# Altium project Battman.PrjPcb (part 2 of 3)

## Sheet AuxSupply_USB.SchDoc
size A4; SheetNumber: 6; SheetTotal: 10
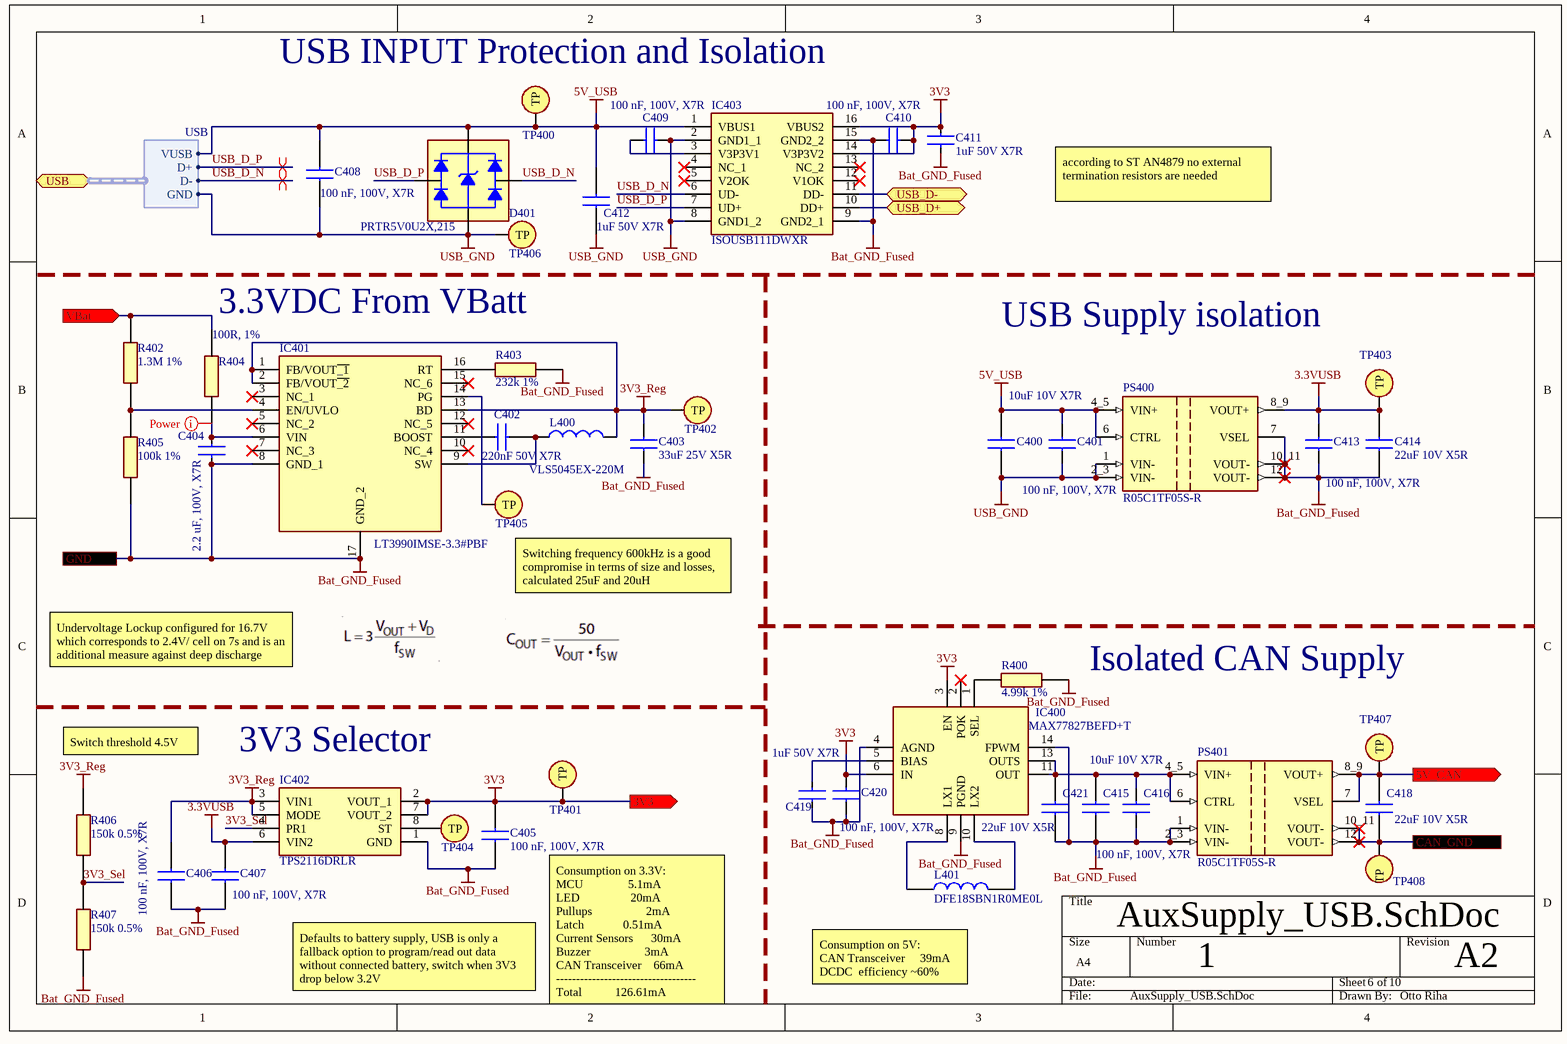
[diagram p5: AuxSupply_USB.SchDoc]

### Parts
C400  10uF 10V X7R  [GRM18x]
C401  100 nF, 100V, X7R  [MAJx16]
C402  220nF 50V X7R  [GRM18x]
C403  33uF 25V X5R  [CAPC3216X180N]
C404  2.2 uF, 100V, X7R  [CAPC2012X145N]
C405  100 nF, 100V, X7R  [MAJx16]
C406  100 nF, 100V, X7R  [MAJx16]
C407  100 nF, 100V, X7R  [MAJx16]
C408  100 nF, 100V, X7R  [MAJx16]
C409  100 nF, 100V, X7R  [MAJx16]
C410  100 nF, 100V, X7R  [MAJx16]
C411  1uF 50V X7R  [CAPC1608X90N]
C412  1uF 50V X7R  [CAPC1608X90N]
C413  100 nF, 100V, X7R  [MAJx16]
C414  22uF 10V X5R  [CAPC1608X105N]
C415  10uF 10V X7R  [GRM18x]
C416  100 nF, 100V, X7R  [MAJx16]
C418  22uF 10V X5R  [CAPC1608X105N]
C419  1uF 50V X7R  [CAPC1608X90N]
C420  100 nF, 100V, X7R  [MAJx16]
C421  22uF 10V X5R  [CAPC1608X105N]
D401  PRTR5V0U2X,215  [PRTR5V0U2X]
IC400  MAX77827BEFD+T  [MAX77827BEFDT]
IC401  LT3990IMSE-3.3#PBF  [SOP50P490X110-17N]
IC402  TPS2116DRLR  [SOTFL50P160X60-8N]
IC403  ISOUSB111DWXR  [SOP65P1030X260-16N]
L400  VLS5045EX-220M  [VLS5045EX330M]
L401  DFE18SBN1R0ME0L  [DFE18SAN1R0ME0L]
PS400  R05C1TF05S-R  [CONV_R05C1TF05S-R]
PS401  R05C1TF05S-R  [CONV_R05C1TF05S-R]
R400  4.99k 1%  [RESC0603X26N]
R402  1.3M 1%  [RESC1608X55N]
R403  232k 1%  [RESC1608X50N]
R404  100R, 1%  [RESC1608X50N]
R405  100k 1%  [RESC1608X55N]
R406  150k 0.5%  [ERA3AEB101V]
R407  150k 0.5%  [ERA3AEB101V]
TP400  Testpoint  [Testpoint]  (value not drawn)
TP401  Testpoint  [Testpoint]  (value not drawn)
TP402  Testpoint  [Testpoint]  (value not drawn)
TP403  Testpoint  [Testpoint]  (value not drawn)
TP404  Testpoint  [Testpoint]  (value not drawn)
TP405  Testpoint  [Testpoint]  (value not drawn)
TP406  Testpoint  [Testpoint]  (value not drawn)
TP407  Testpoint  [Testpoint]  (value not drawn)
TP408  Testpoint  [Testpoint]  (value not drawn)

### Ports
3V3 (out, see Main[4D], MCU[1A], PowerPath[1B], Singlepath[1B]), 5V_CAN (out, see Main[4D], MCU[1C]), CAN_GND (see Main[4D], MCU[1C]), GND (see Main[4D], LTC_Hardware[1D], MCU[1A], PowerPath[1B], Singlepath[1C]), USB (bidir, harness USB, see Main[4D]), USB_D+ (bidir, see Main[4D], MCU[4C]), USB_D- (bidir, see Main[4D], MCU[4C]), VBat (in, see Main[4D])

### Harnesses
USB: VUSB, D+, D-, GND

### Nets
3.3VUSB: C407.2 C413.1 C414.2 IC402.6(VIN2) PS400.8_9(VOUT+) TP403.1(TP)
3V3: C405.2 C410.1 C411.2 C420.1 IC400.3(EN) IC400.6(IN) IC402.2(VOUT_1) IC402.7(VOUT_2) IC403.14(V3P3V2) IC403.16(VBUS2) TP401.1(TP) ; port 3V3  [project net 3.3V]
3V3_Reg: C403.2 C406.2 IC401.1(FB/VOUT~{_1}) IC401.2(FB/VOUT~{_2}) IC401.13(BD) IC402.3(VIN1) IC402.5(MODE) L400.2 R406.2 TP402.1(TP)
5V: C418.2 PS401.7(VSEL) PS401.8_9(VOUT+) TP407.1(TP) ; port 5V_CAN
5V_USB: C400.2 C401.1 C408.2 C412.1 D401.4(supply_voltage) IC403.1(VBUS1) PS400.4_5(VIN+) PS400.6(CTRL) TP400.1(TP) ; port USB.VUSB
Bat_GND_Fused: C403.1 C404.1 C405.1 C406.1 C407.1 C410.2 C411.1 C413.2 C414.1 C415.1 C416.2 C419.1 C420.2 C421.1 IC400.4(AGND) IC400.9(PGND) IC400.14(FPWM) IC401.8(GND_1) IC401.17(GND_2) IC402.1(GND) IC403.9(GND2_1) IC403.15(GND2_2) PS400.7(VSEL) PS400.10_11(VOUT-) PS400.12(VOUT-) PS401.1(VIN-) PS401.2_3(VIN-) R400.2 R403.2 R405.1 R407.1 ; port GND
CAN_GND: C418.1 PS401.10_11(VOUT-) PS401.12(VOUT-) TP408.1(TP) ; port CAN_GND
USB_GND: C400.1 C401.2 C408.1 C409.1 C412.2 D401.1(ground) IC403.2(GND1_1) IC403.8(GND1_2) PS400.1(VIN-) PS400.2_3(VIN-) TP406.1(TP) ; port USB.GND
V_Bat_Fused: R402.2 R404.2 ; port VBat
3V3_Sel: IC402.4(PR1) R406.1 R407.2
USB_D_N: D401.3(input/output_2) IC403.6(UD-) ; port USB.D-
USB_D_P: D401.2(input/output_1) IC403.7(UD+) ; port USB.D+
USB_ISO_N: IC403.11(DD-) ; port USB_D-
USB_ISO_P: IC403.10(DD+) ; port USB_D+
NetC402_1: C402.1 IC401.11(BOOST)
NetC402_2: C402.2 IC401.9(SW) L400.1
NetC404_2: C404.2 IC401.6(VIN) R404.1
NetC409_2: C409.2 IC403.3(V3P3V1)
NetC415_2: C415.2 C416.1 C421.2 IC400.11(OUT) IC400.13(OUTS) PS401.4_5(VIN+) PS401.6(CTRL)
NetC419_2: C419.2 IC400.5(BIAS)
NetIC400_1: IC400.1(SEL) R400.1
NetIC400_8: IC400.8(LX1) L401.1
NetIC400_10: IC400.10(LX2) L401.2
NetIC401_4: IC401.4(EN/UVLO) R402.1 R405.2
NetIC401_14: IC401.14(PG) TP405.1(TP)
NetIC401_16: IC401.16(RT) R403.1
NetIC402_8: IC402.8(ST) TP404.1(TP)

Not connected (* = marked no-connect by the designer): IC400 2(POK)*; IC401 3(NC_1)* 5(NC_2)* 7(NC_3)* 10(NC_4)* 12(NC_5)* 15(NC_6)*; IC403 4(NC_1)* 5(V2OK)* 12(V1OK)* 13(NC_2)*

### Layout directives
differential pair: USB_D_N, USB_D_P
net class Batt+: NetC404_2

### Notes on the sheet
- USB INPUT Protection and Isolation
- according to ST AN4879 no external termination resistors are needed
- 3.3VDC From VBatt
- USB Supply isolation
- (near TP405) Switching frequency 600kHz is a good compromise in terms of size and losses, calculated 25uF and 20uH
- Undervoltage Lockup configured for 16.7V which corresponds to 2.4V/ cell on 7s and is an additional measure against deep discharge
- Isolated CAN Supply
- Switch threshold 4.5V
- (near IC402) 3V3 Selector
- Defaults to battery supply, USB is only a fallback option to program/read out data without connected battery, switch when 3V3 drop below 3.2V
- (near L401) Consumption on 5V:
  CAN Transceiver     39mA
  DCDC  efficiency ~60%
- 1
- A2
- Consumption on 3.3V:
  MCU 	             5.1mA
  LED  	              20mA
  Pullups 	                2mA
  Latch 	           0.51mA
  Current Sensors      30mA
  Buzzer 	                3mA
  CAN Transceiver    66mA
  -----------------------------------
  Total 	         126.61mA
- Otto Riha

### Library data of the parts
C400 C415 = GRM188Z71A106MA73D: Capacitor; Manufacturer_Name: Murata Electronics; Datasheet Link: https://search.murata.co.jp/Ceramy/image/img/A01X/G101/ENG/GRM188Z71A106MA73-01A.pdf; Height: 0.9mm; Manufacturer_Part_Number: GRM188Z71A106MA73D; Mouser Part Number: 81-GRM188Z71A106MA3D; Mouser Price/Stock: https://www.mouser.co.uk/ProductDetail/Murata-Electronics/GRM188Z71A106MA73D?qs=Y%252BBGkTaltXt4aDn0%2FsxyNQ%3D%3D; Arrow Part Number: GRM188Z71A106MA73D; Arrow Price/Stock: https://www.arrow.com/en/products/grm188z71a106ma73d/murata-manufacturing?utm_currency=USD&region=europe
C401 C405-C410 C413 C416 C420 = MAJCH168BB7104KTEA01: as C303 on sheet LTC_Hardware; Datasheet Link: https://ds.yuden.co.jp/TYCOMPAS/or/detail?pn=MAJCH168BB7104KTEA01; Height: 0.8mm; Manufacturer_Part_Number: MAJCH168BB7104KTEA01; Mouser Part Number: 963-MAJCH168BB7104KT; Mouser Price/Stock: https://www.mouser.co.uk/ProductDetail/TAIYO-YUDEN/MAJCH168BB7104KTEA01?qs=ZcfC38r4PovaTBrG0IdezQ%3D%3D; Arrow Part Number: MAJCH168BB7104KTEA01; Arrow Price/Stock: https://www.arrow.com/en/products/majch168bb7104ktea01/taiyo-yuden?utm_currency=USD&region=nac; Supplier 1: Mouser; Supplier Part Number 1: 963-MAJCH168BB7104KT
C402 = GRM188R71H224KAC4J: Capacitor; Manufacturer_Name: Murata Electronics; Datasheet Link: https://search.murata.co.jp/Ceramy/image/img/A01X/G101/ENG/GRM188R71H224KAC4-01A.pdf; Height: 0.9mm; Manufacturer_Part_Number: GRM188R71H224KAC4J; Mouser Part Number: 81-GRM188R71H224KA4J; Mouser Price/Stock: https://www.mouser.co.uk/ProductDetail/Murata-Electronics/GRM188R71H224KAC4J?qs=jHkklCh7amjbWVXSvnFGBA%3D%3D; Arrow Part Number: GRM188R71H224KAC4J; Arrow Price/Stock: https://www.arrow.com/en/products/grm188r71h224kac4j/murata-manufacturing
C403 = C3216X5R1E336M160AC: Capacitor 33uF 25V X5R; Manufacturer_Name: TDK; Datasheet Link: https://product.tdk.com/info/en/catalog/datasheets/mlcc_commercial_midvoltage_en.pdf; Height: 1.8mm; Manufacturer_Part_Number: C3216X5R1E336M160AC; Mouser Part Number: 810-C3216X5R1E336M; Mouser Price/Stock: https://www.mouser.co.uk/ProductDetail/TDK/C3216X5R1E336M160AC?qs=LcTL%2F5vFEzFIMvFz4LzwTw%3D%3D; Arrow Part Number: C3216X5R1E336M160AC; Arrow Price/Stock: https://www.arrow.com/en/products/c3216x5r1e336m160ac/tdk
C404 = C2012X7R2A225K125AC: Capacitor 2.2 uF, 100V, X7R; Manufacturer_Name: TDK; Datasheet Link: https://product.tdk.com/info/en/catalog/datasheets/mlcc_commercial_midvoltage_en.pdf; Height: 1.45mm; Manufacturer_Part_Number: C2012X7R2A225K125AC; Mouser Part Number: 810-C2012X7R2225K125; Mouser Price/Stock: https://www.mouser.co.uk/ProductDetail/TDK/C2012X7R2A225K125AC?qs=17ckDYBRdekDf%2FwiwHq7Mg%3D%3D; Arrow Part Number: C2012X7R2A225K125AC; Arrow Price/Stock: https://www.arrow.com/en/products/c2012x7r2a225k125ac/tdk?utm_currency=USD&region=nac; Supplier 1: Mouser; Supplier Part Number 1: 810-C2012X7R2225K125
C411 C412 C419 = 06035C105MAT2A: Capacitor 1uF 50V X7R; Manufacturer_Name: Kyocera AVX; Datasheet Link: https://componentsearchengine.com/Datasheets/1/06031A100FAT2A.pdf; Height: 0.9mm; Manufacturer_Part_Number: 06035C105MAT2A; Mouser Part Number: 581-06035C105MAT2A; Mouser Price/Stock: https://www.mouser.co.uk/ProductDetail/KYOCERA-AVX/06035C105MAT2A?qs=%252BdQmOuGyFcHMsevPtc6OZQ%3D%3D; Value: 1uF
C414 C418 C421 = CL10A226MP8NUNE: Capacitor; Manufacturer_Name: SAMSUNG; Datasheet Link: https://datasheet.datasheetarchive.com/originals/distributors/Datasheets-DGA10/2407063.pdf; Height: 1.05mm; Manufacturer_Part_Number: CL10A226MP8NUNE; Mouser Part Number: 187-CL10A226MP8NUNE; Mouser Price/Stock: https://www.mouser.co.uk/ProductDetail/Samsung-Electro-Mechanics/CL10A226MP8NUNE?qs=gRKWieUq2Hb5O0PTfRKzDQ%3D%3D; Arrow Part Number: CL10A226MP8NUNE; Arrow Price/Stock: https://www.arrow.com/en/products/cl10a226mp8nune/samsung-electro-mechanics?region=europe
D401 = PRTR5V0U2X,215: Diode; Manufacturer_Name: Nexperia; Datasheet Link: https://assets.nexperia.com/documents/data-sheet/PRTR5V0U2X.pdf; Height: 1.1mm; Manufacturer_Part_Number: PRTR5V0U2X,215; Mouser Part Number: 771-PRTR5V0U2X-T/R; Mouser Price/Stock: https://www.mouser.co.uk/ProductDetail/Nexperia/PRTR5V0U2X215?qs=LOCUfHb8d9sDkgY4cRj8Lw%3D%3D; Arrow Part Number: PRTR5V0U2X,215; Arrow Price/Stock: https://www.arrow.com/en/products/prtr5v0u2x215/nexperia?utm_currency=USD&region=europe
IC400 = MAX77827BEFD+T: Integrated Circuit; Manufacturer_Name: Analog Devices; Datasheet Link: https://www.analog.com/media/en/technical-documentation/data-sheets/MAX77827.pdf; Height: 0.6mm; Manufacturer_Part_Number: MAX77827BEFD+T; Mouser Part Number: 700-MAX77827BEFD+T; Mouser Price/Stock: https://www.mouser.co.uk/ProductDetail/Analog-Devices-Maxim-Integrated/MAX77827BEFD%2bT?qs=yqaQSyyJnNgFOTHEkqA3ww%3D%3D; Arrow Part Number: MAX77827BEFD+T; Arrow Price/Stock: https://www.arrow.com/en/products/max77827befdt/analog-devices?utm_currency=USD&region=nac
IC401 = LT3990IMSE-3.3#PBF: Integrated Circuit; Manufacturer_Name: Analog Devices; Datasheet Link: https://www.analog.com/LT3990/datasheet; Height: 1.1mm; Manufacturer_Part_Number: LT3990IMSE-3.3#PBF; Mouser Part Number: 584-3990IMSE-3.3PBF; Mouser Price/Stock: https://www.mouser.co.uk/ProductDetail/Analog-Devices/LT3990IMSE-3.3PBF?qs=hVkxg5c3xu8pU5y8AinUWQ%3D%3D; Arrow Part Number: LT3990IMSE-3.3#PBF; Arrow Price/Stock: https://www.arrow.com/en/products/lt3990imse-3.3pbf/analog-devices?region=nac
IC402 = TPS2116DRLR: Integrated Circuit; Manufacturer_Name: Texas Instruments; Datasheet Link: https://www.ti.com/lit/gpn/tps2116; Height: 0.6mm; Manufacturer_Part_Number: TPS2116DRLR; Mouser Part Number: 595-TPS2116DRLR; Mouser Price/Stock: https://www.mouser.co.uk/ProductDetail/Texas-Instruments/TPS2116DRLR?qs=aP1CjGhiNiGo3XAyXcVPaQ%3D%3D; Arrow Part Number: TPS2116DRLR; Arrow Price/Stock: https://www.arrow.com/en/products/tps2116drlr/texas-instruments?utm_currency=USD&region=nac
IC403 = ISOUSB111DWXR: Integrated Circuit; Manufacturer_Name: Texas Instruments; Datasheet Link: https://www.ti.com/lit/ds/symlink/isousb111.pdf?ts=1669697942868&ref_url=https%253A%252F%252Fwww.ti.com%252Fproduct%252FISOUSB111%253FkeyMatch%253DISOUSB111DWXR%2526tisearch%253Dsearch-everything%2526usecase%253DOPN; Height: 2.6mm; Manufacturer_Part_Number: ISOUSB111DWXR; Mouser Part Number: 595-ISOUSB111DWXR; Mouser Price/Stock: https://www.mouser.co.uk/ProductDetail/Texas-Instruments/ISOUSB111DWXR?qs=Y0Uzf4wQF3msEozH7EwD3g%3D%3D; Arrow Part Number: ISOUSB111DWXR; Arrow Price/Stock: https://www.arrow.com/en/products/isousb111dwxr/texas-instruments?region=nac
L400 = VLS5045EX-220M: Inductor; Manufacturer_Name: TDK; Datasheet Link: https://product.tdk.com/system/files/dam/doc/product/inductor/inductor/smd/catalog/inductor_commercial_power_vls5045ex_en.pdf; Height: 4mm; Manufacturer_Part_Number: VLS5045EX-220M; Mouser Part Number: 810-VLS5045EX-220M; Mouser Price/Stock: https://www.mouser.co.uk/ProductDetail/TDK/VLS5045EX-220M?qs=oF%2FSscNnLpAAQL9ec5VdpA%3D%3D; Arrow Part Number: VLS5045EX-220M; Arrow Price/Stock: https://www.arrow.com/en/products/vls5045ex-220m/tdk?region=nac
L401 = DFE18SBN1R0ME0L: Inductor; Manufacturer_Name: Murata Electronics; Datasheet Link: https://search.murata.co.jp/Ceramy/image/img/P02/JETE243A-0041.pdf; Height: 0.8mm; Manufacturer_Part_Number: DFE18SBN1R0ME0L; Mouser Part Number: 81-DFE18SBN1R0ME0L; Mouser Price/Stock: https://www.mouser.co.uk/ProductDetail/Murata-Electronics/DFE18SBN1R0ME0L?qs=byeeYqUIh0Mps9dQtDnpsA%3D%3D
PS400 PS401 = R05C1TF05S-R: MF: {'manufacturer': u'Recom Power'}; Package: None; Price: None; Value: *; MP: R05C1TF05S-R; Availability: Unavailable
R400 = CR0201-FW-4991GLF: Resistor; Manufacturer_Name: Bourns; Datasheet Link: https://www.bourns.com/pdfs/chpreztr.pdf; Height: 0.26mm; Manufacturer_Part_Number: CR0201-FW-4991GLF; Mouser Part Number: 652-CR0201FW-4991GLF; Mouser Price/Stock: https://www.mouser.co.uk/ProductDetail/Bourns/CR0201-FW-4991GLF?qs=W7X4MxMep48JtJbJXkcmpg%3D%3D
R402 = MCT0603MD1304BP500: Resistor 1.3M 1%; Manufacturer_Name: Vishay; Datasheet Link: http://www.vishay.com/docs/28705/mcx0x0xpro.pdf; Height: 0.55mm; Manufacturer_Part_Number: MCT0603MD1304BP500; Mouser Part Number: 594-MCT0603MD1304BP5; Mouser Price/Stock: https://www.mouser.co.uk/ProductDetail/Vishay/MCT0603MD1304BP500?qs=Jslch3jnSjn3NEL17BAJuQ%3D%3D; Value: 1.3M; Supplier 1: Mouser; Supplier Part Number 1: 594-MCT0603MD1304BP5
R403 = CRCW0603232KFKEA: Resistor; Manufacturer_Name: Vishay; Datasheet Link: http://www.vishay.com/docs/20035/dcrcwe3.pdf; Height: 0.5mm; Manufacturer_Part_Number: CRCW0603232KFKEA; Mouser Part Number: 71-CRCW0603-232K-E3; Mouser Price/Stock: https://www.mouser.co.uk/ProductDetail/Vishay-Dale/CRCW0603232KFKEA?qs=NHKSztHah43mx5UrSmXOxA%3D%3D; Arrow Part Number: CRCW0603232KFKEA; Arrow Price/Stock: https://www.arrow.com/en/products/crcw0603232kfkea/vishay
R404 = CRCW0603100RFKEA: Resistor 100R, 1%; Manufacturer_Name: Vishay; Datasheet Link: http://www.vishay.com/docs/20035/dcrcwe3.pdf; Height: 0.5mm; Manufacturer_Part_Number: CRCW0603100RFKEA; Mouser Part Number: 71-CRCW0603-100-E3; Mouser Price/Stock: https://www.mouser.co.uk/ProductDetail/Vishay-Dale/CRCW0603100RFKEA?qs=90AHS1y%2FsidGWjjxZAupKg%3D%3D; Arrow Part Number: CRCW0603100RFKEA; Arrow Price/Stock: https://www.arrow.com/en/products/crcw0603100rfkea/vishay?utm_currency=USD&region=europe; Value: 100R; Supplier 1: Mouser; Supplier Part Number 1: 71-CRCW0603-100-E3
R405 = CRCW0603100KFKEAC: Resistor 100k, 1%; Manufacturer_Name: Vishay; Datasheet Link: https://www.mouser.com/datasheet/2/427/crcwce3-1223726.pdf; Height: 0.55mm; Manufacturer_Part_Number: CRCW0603100KFKEAC; Mouser Part Number: 71-CRCW0603100KFKEAC; Mouser Price/Stock: https://www.mouser.co.uk/ProductDetail/Vishay-Dale/CRCW0603100KFKEAC?qs=E3Y5ESvWgWPxzfNYyMgX1w%3D%3D; Arrow Part Number: CRCW0603100KFKEAC; Arrow Price/Stock: https://www.arrow.com/en/products/crcw0603100kfkeac/vishay?utm_currency=USD&region=nac; Value: 100k; Supplier 1: Mouser; Supplier Part Number 1: 71-CRCW0603100KFKEAC
R406 R407 = ERA-3AED154V: Resistor 150k 0.5%; Manufacturer_Name: Panasonic; Datasheet Link: https://industrial.panasonic.com/cdbs/www-data/pdf/RDM0000/AOA0000C307.pdf; Height: 0.55mm; Manufacturer_Part_Number: ERA-3AED154V; Mouser Part Number: 667-ERA-3AED154V; Mouser Price/Stock: https://www.mouser.co.uk/ProductDetail/Panasonic/ERA-3AED154V?qs=MNPzkKEzRtSm98HasUBZjQ%3D%3D; Arrow Part Number: ERA-3AED154V; Arrow Price/Stock: https://www.arrow.com/en/products/era-3aed154v/panasonic?region=nac; Supplier 1: Mouser; Supplier Part Number 1: 667-ERA-3AED154V

## Sheet LTC_Soft.SchDoc
size A4; SheetNumber: 7; SheetTotal: 10
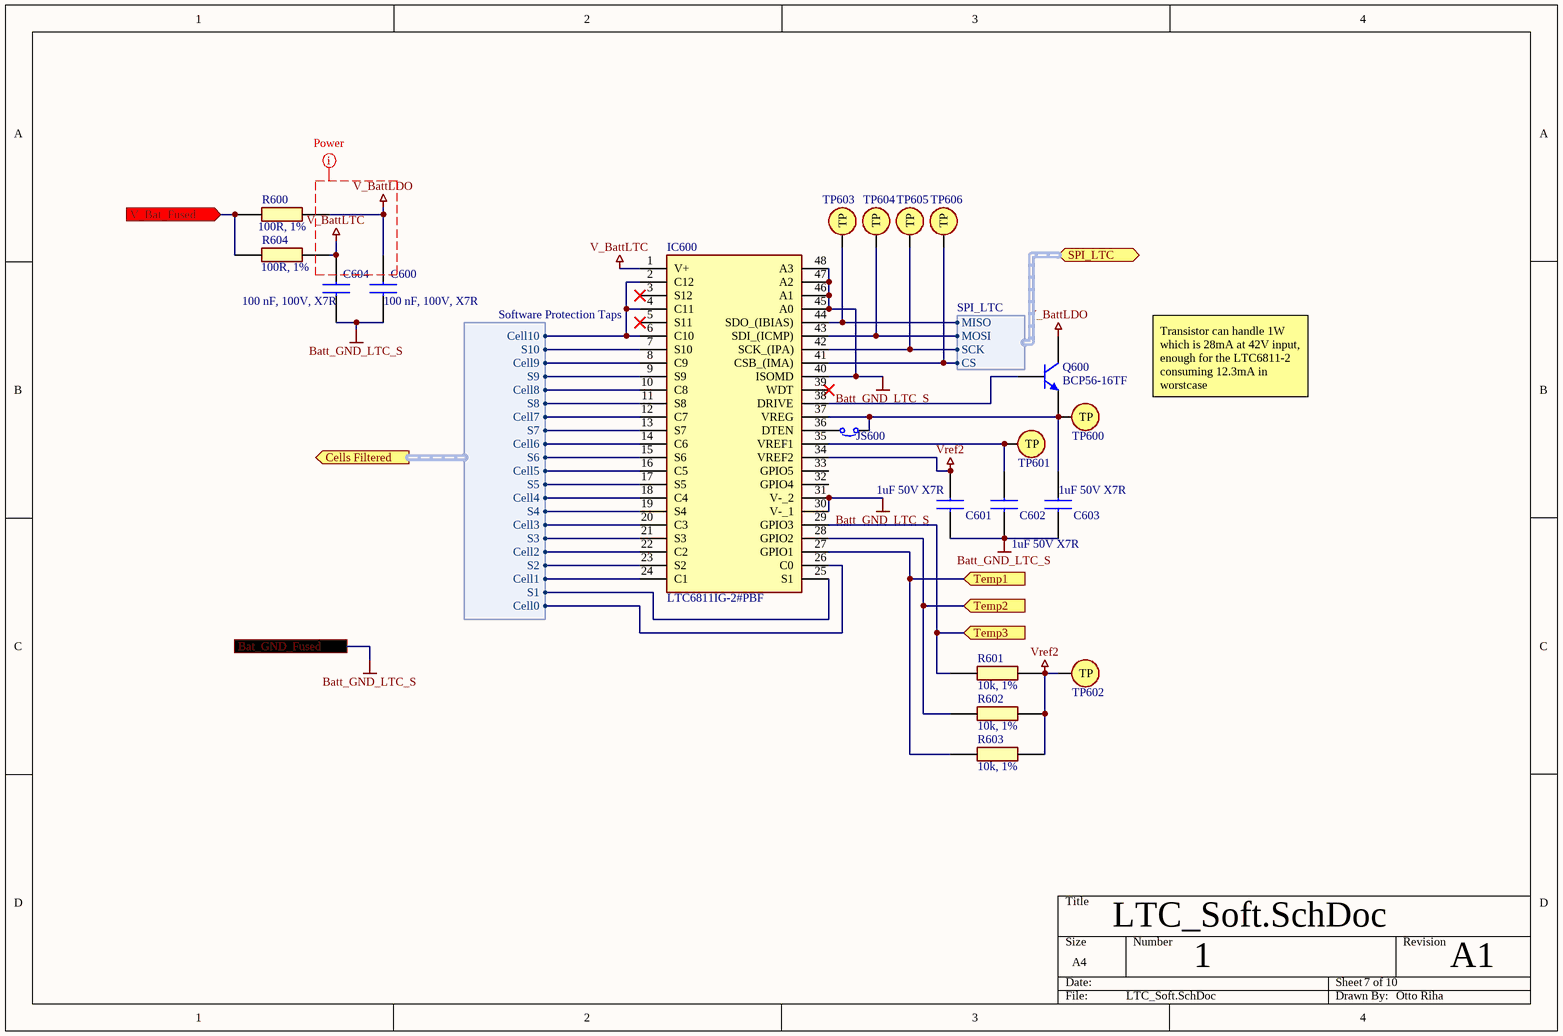
[diagram p6: LTC_Soft.SchDoc]

### Parts
C600  100 nF, 100V, X7R  [MAJx16]
C601  1uF 50V X7R  [CAPC1608X90N]
C602  1uF 50V X7R  [CAPC1608X90N]
C603  1uF 50V X7R  [CAPC1608X90N]
C604  100 nF, 100V, X7R  [MAJx16]
IC600  LTC6811IG-2#PBF  [SOP50P780X200-48N]
JS600  SolderJumper  [SolderJumper]  (value not drawn)
Q600  BCP56-16TF  [SOT230P700X180-4N]
R600  100R, 1%  [RESC1608X50N]
R601  value 10k, 1%  [RESC1608X50N]  (hidden comment: CRCW060310K0FKEI)
R602  value 10k, 1%  [RESC1608X50N]  (hidden comment: CRCW060310K0FKEI)
R603  value 10k, 1%  [RESC1608X50N]  (hidden comment: CRCW060310K0FKEI)
R604  100R, 1%  [RESC1608X50N]
TP600  Testpoint  [Testpoint]  (value not drawn)
TP601  Testpoint  [Testpoint]  (value not drawn)
TP602  Testpoint  [Testpoint]  (value not drawn)
TP603  Testpoint  [Testpoint]  (value not drawn)
TP604  Testpoint  [Testpoint]  (value not drawn)
TP605  Testpoint  [Testpoint]  (value not drawn)
TP606  Testpoint  [Testpoint]  (value not drawn)

### Ports
Bat_GND_Fused (see Main[4B]), Cells Filtered (out, harness Software Protection Taps, see Main[4B]), SPI_LTC (bidir, harness SPI_LTC, see Main[4B], MCU[3C]), Temp1 (in, see Main[4B]), Temp2 (in, see Main[4B]), Temp3 (in, see Main[4B]), V_Bat_Fused (in, see Main[4B])

### Harnesses
Software Protection Taps: Cell0, Cell1, Cell2, Cell3, Cell4, Cell5, Cell6, Cell7, Cell8, Cell9, Cell10, S1, S2, S3, S4, S5, S6, S7, S8, S9, S10
SPI_LTC: MOSI, MISO, SCK, CS

### Nets
Batt_GND_LTC_S: C600.1 C601.2 C602.2 C603.2 C604.1 IC600.30(V-_1) IC600.31(V-_2) IC600.40(ISOMD) IC600.45(A0) IC600.46(A1) IC600.47(A2) IC600.48(A3) ; port Bat_GND_Fused  [project net Bat_GND_Fused]
Cell0: IC600.26(C0) ; port Cells Filtered.Cell0
V_Bat_Fused: R600.1 R604.1 ; port V_Bat_Fused
V_BattLDO: C600.2 Q600.2(C) R600.2
V_BattLTC: C604.2 IC600.1(V+) R604.2
Vref2: C601.1 IC600.34(VREF2) R601.1 R602.1 R603.1 TP602.1(TP)
LTC_S_C1: IC600.24(C1) ; port Cells Filtered.Cell1
LTC_S_C2: IC600.22(C2) ; port Cells Filtered.Cell2
LTC_S_C3: IC600.20(C3) ; port Cells Filtered.Cell3
LTC_S_C4: IC600.18(C4) ; port Cells Filtered.Cell4
LTC_S_C5: IC600.16(C5) ; port Cells Filtered.Cell5
LTC_S_C6: IC600.14(C6) ; port Cells Filtered.Cell6
LTC_S_C7: IC600.12(C7) ; port Cells Filtered.Cell7
LTC_S_C8: IC600.10(C8) ; port Cells Filtered.Cell8
LTC_S_C9: IC600.8(C9) ; port Cells Filtered.Cell9
LTC_S_C10: IC600.2(C12) IC600.4(C11) IC600.6(C10) ; port Cells Filtered.Cell10
LTC_S_S1: IC600.25(S1) ; port Cells Filtered.S1
LTC_S_S2: IC600.23(S2) ; port Cells Filtered.S2
LTC_S_S3: IC600.21(S3) ; port Cells Filtered.S3
LTC_S_S4: IC600.19(S4) ; port Cells Filtered.S4
LTC_S_S5: IC600.17(S5) ; port Cells Filtered.S5
LTC_S_S6: IC600.15(S6) ; port Cells Filtered.S6
LTC_S_S7: IC600.13(S7) ; port Cells Filtered.S7
LTC_S_S8: IC600.11(S8) ; port Cells Filtered.S8
LTC_S_S9: IC600.9(S9) ; port Cells Filtered.S9
LTC_S_S10: IC600.7(S10) ; port Cells Filtered.S10
Temp1: IC600.27(GPIO1) R603.2 ; port Temp1
Temp2: IC600.28(GPIO2) R602.2 ; port Temp2
Temp3: IC600.29(GPIO3) R601.2 ; port Temp3
NetC602_1: C602.1 IC600.35(VREF1) TP601.1(TP)
NetC603_1: C603.1 IC600.37(VREG) JS600.2 Q600.3(E) TP600.1(TP)
NetIC600_36: IC600.36(DTEN) JS600.1
NetIC600_38: IC600.38(DRIVE) Q600.1(B)
NetIC600_41: IC600.41(CSB_(IMA)) TP606.1(TP) ; port SPI_LTC.CS
NetIC600_42: IC600.42(SCK_(IPA)) TP605.1(TP) ; port SPI_LTC.SCK
NetIC600_43: IC600.43(SDI_(ICMP)) TP604.1(TP) ; port SPI_LTC.MOSI
NetIC600_44: IC600.44(SDO_(IBIAS)) TP603.1(TP) ; port SPI_LTC.MISO

Not connected (* = marked no-connect by the designer): IC600 3(S12)* 5(S11)* 32(GPIO4) 33(GPIO5) 39(WDT)*

### Layout directives
net class Batt+: V_BattLDO, V_BattLTC

### Notes on the sheet
- Transistor can handle 1W which is 28mA at 42V input, enough for the LTC6811-2 consuming 12.3mA in worstcase
- 1
- A1
- Otto Riha

### Library data of the parts
C600 C604 = MAJCH168BB7104KTEA01: as C303 on sheet LTC_Hardware; Datasheet Link: https://ds.yuden.co.jp/TYCOMPAS/or/detail?pn=MAJCH168BB7104KTEA01; Height: 0.8mm; Manufacturer_Part_Number: MAJCH168BB7104KTEA01; Mouser Part Number: 963-MAJCH168BB7104KT; Mouser Price/Stock: https://www.mouser.co.uk/ProductDetail/TAIYO-YUDEN/MAJCH168BB7104KTEA01?qs=ZcfC38r4PovaTBrG0IdezQ%3D%3D; Arrow Part Number: MAJCH168BB7104KTEA01; Arrow Price/Stock: https://www.arrow.com/en/products/majch168bb7104ktea01/taiyo-yuden?utm_currency=USD&region=nac; Supplier 1: Mouser; Supplier Part Number 1: 963-MAJCH168BB7104KT
C601-C603 = 06035C105MAT2A: as C411 on sheet AuxSupply_USB; Datasheet Link: https://componentsearchengine.com/Datasheets/1/06031A100FAT2A.pdf; Height: 0.9mm; Manufacturer_Part_Number: 06035C105MAT2A; Mouser Part Number: 581-06035C105MAT2A; Mouser Price/Stock: https://www.mouser.co.uk/ProductDetail/KYOCERA-AVX/06035C105MAT2A?qs=%252BdQmOuGyFcHMsevPtc6OZQ%3D%3D; Value: 1uF
IC600 = LTC6811IG-2#PBF: Integrated Circuit; Manufacturer_Name: Analog Devices; Datasheet Link: https://datasheet.datasheetarchive.com/originals/distributors/DKDS42/DSANUWW0041878.pdf; Height: 2mm; Manufacturer_Part_Number: LTC6811IG-2#PBF; Mouser Part Number: 584-LTC6811IG-2#PBF; Mouser Price/Stock: https://www.mouser.co.uk/ProductDetail/Analog-Devices/LTC6811IG-2PBF?qs=oahfZPh6IAI0fFYgAupCpg%3D%3D; Arrow Part Number: LTC6811IG-2#PBF; Arrow Price/Stock: https://www.arrow.com/en/products/ltc6811ig-2pbf/analog-devices?region=nac
Q600 = BCP56-16TF: Transistor BJT NPN; Manufacturer_Name: Nexperia; Datasheet Link: https://assets.nexperia.com/documents/data-sheet/BCP56T_SER.pdf; Height: 1.8mm; Manufacturer_Part_Number: BCP56-16TF; Mouser Part Number: 771-BCP56-16TF; Mouser Price/Stock: https://www.mouser.co.uk/ProductDetail/Nexperia/BCP56-16TF?qs=uj7TeyS2Sj96ubfysKmpcg%3D%3D; Arrow Part Number: BCP56-16TF; Arrow Price/Stock: https://www.arrow.com/en/products/bcp56-16tf/nexperia?region=nac
R600 R604 = CRCW0603100RFKEA: as R404 on sheet AuxSupply_USB; Datasheet Link: http://www.vishay.com/docs/20035/dcrcwe3.pdf; Height: 0.5mm; Manufacturer_Part_Number: CRCW0603100RFKEA; Mouser Part Number: 71-CRCW0603-100-E3; Mouser Price/Stock: https://www.mouser.co.uk/ProductDetail/Vishay-Dale/CRCW0603100RFKEA?qs=90AHS1y%2FsidGWjjxZAupKg%3D%3D; Arrow Part Number: CRCW0603100RFKEA; Arrow Price/Stock: https://www.arrow.com/en/products/crcw0603100rfkea/vishay?utm_currency=USD&region=europe; Supplier 1: Mouser; Supplier Part Number 1: 71-CRCW0603-100-E3; Value: 100R
R601-R603 = CRCW060310K0FKEI: Resistor 10k, 1%; Manufacturer_Name: Vishay; Datasheet Link: http://www.vishay.com/docs/20035/dcrcwe3.pdf; Height: 0.5mm; Manufacturer_Part_Number: CRCW060310K0FKEI; Mouser Part Number: 71-CRCW060310K0FKEI; Mouser Price/Stock: https://www.mouser.co.uk/ProductDetail/Vishay-Dale/CRCW060310K0FKEI?qs=3qWEzBg5KnKofE%252B8acPBRA%3D%3D; Arrow Part Number: CRCW060310K0FKEI; Arrow Price/Stock: https://www.arrow.com/en/products/crcw060310k0fkei/vishay?utm_currency=USD&region=nac; Supplier 1: Mouser; Supplier Part Number 1: 71-CRCW060310K0FKEI

## Sheet MCU.SchDoc
size A4; SheetNumber: 8; SheetTotal: 10
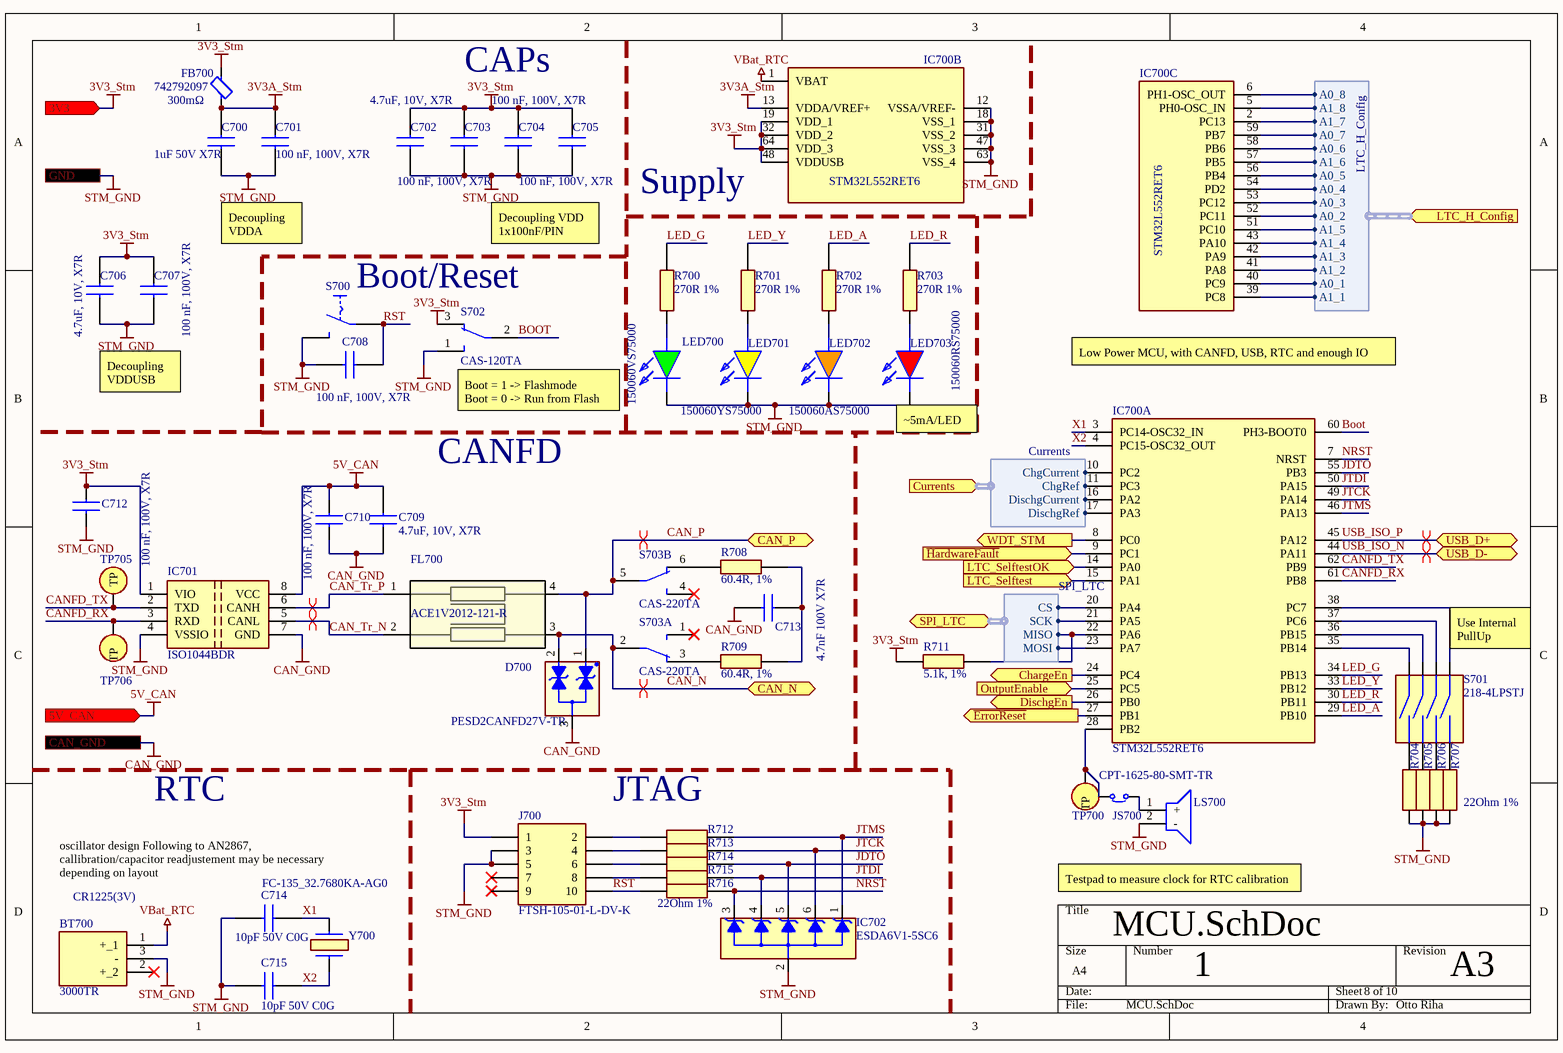
[diagram p7: MCU.SchDoc]

### Parts
(Parts that share a designator on the sheet are numbered #1, #2 ... from top to bottom, then left to right.)
BT700  3000TR  [3000TR]
C700  1uF 50V X7R  [CAPC1608X90N]
C701  100 nF, 100V, X7R  [MAJx16]
C702  4.7uF, 10V, X7R  [GRM18x]
C703  100 nF, 100V, X7R  [MAJx16]
C704  100 nF, 100V, X7R  [MAJx16]
C705  100 nF, 100V, X7R  [MAJx16]
C706  4.7uF, 10V, X7R  [GRM18x]
C707  100 nF, 100V, X7R  [MAJx16]
C708  100 nF, 100V, X7R  [MAJx16]
C709  4.7uF, 10V, X7R  [GRM18x]
C710  100 nF, 100V, X7R  [MAJx16]
C712  100 nF, 100V, X7R  [MAJx16]
C713  4.7nF 100V X7R  [CAPC1608X80N]
C714  10pF 50V C0G  [CAPC1608X90N]
C715  10pF 50V C0G  [CAPC1608X90N]
D700  PESD2CANFD27V-TR  [SOT95P230X110-3N]
FB700  742792097  DC Resistance (DCR): 300mΩ  [FP-742792097-MFG]
FL700  ACE1V2012-121-R  [ACE1V2012121R]
IC700#1  STM32L552RET6  [QFP50P1200X1200X160-64N]  (part B of 2)
IC700#2  STM32L552RET6  [QFP50P1200X1200X160-64N]  (parts A,C of 3)
IC701  ISO1044BDR  [SOIC127P600X175-8N]
IC702  ESDA6V1-5SC6  [SOT95P280X145-6N]
J700  FTSH-105-01-L-DV-K  [FTSH10501LDVK]
JS700  SolderJumper  [SolderJumper]  (value not drawn)
LED700  150060VS75000  [LEDC1608X80N]
LED701  150060YS75000  [LEDC1608X80N]
LED702  150060AS75000  [LEDC1608X80N]
LED703  150060RS75000  [LEDC1608X80N]
LS700  CPT-1625-80-SMT-TR  [CPT162580SMTTR]
R700  270R 1%  [RESC1608X55N]
R701  270R 1%  [RESC1608X55N]
R702  270R 1%  [RESC1608X55N]
R703  270R 1%  [RESC1608X55N]
R704  22Ohm 1%  [RESC1608X55N]  (value not drawn)
R705  22Ohm 1%  [RESC1608X55N]  (value not drawn)
R706  22Ohm 1%  [RESC1608X55N]  (value not drawn)
R707  22Ohm 1%  [RESC1608X55N]
R708  60.4R, 1%  [RESC1608X55N]
R709  60.4R, 1%  [RESC1608X55N]
R711  5.1k, 1%  [RESC1608X55N]
R712  value 22Ohm  [RESC1608X55N]  (hidden comment: 22Ohm 1%)
R713  value 22Ohm  [RESC1608X55N]  (hidden comment: 22Ohm 1%)
R714  value 22Ohm  [RESC1608X55N]  (hidden comment: 22Ohm 1%)
R715  value 22Ohm  [RESC1608X55N]  (hidden comment: 22Ohm 1%)
R716  22Ohm 1%  [RESC1608X55N]
S700  MJTP1140A  [MJTP1140A]  (value not drawn)
S701  218-4LPSTJ  [2184LPSTJ]
S702  CAS-120TA  [CAS120TA]
S703  CAS-220TA  [CAS220TA]  (parts A,B of 2)
TP700  Testpoint  [Testpoint]  (value not drawn)
TP705  Testpoint  [Testpoint]  (value not drawn)
TP706  Testpoint  [Testpoint]  (value not drawn)
Y700  FC-135_32.7680KA-AG0  [FC135327680KAAG0]

### Ports
3V3 (in, see Main[5C], AuxSupply_USB[2D], PowerPath[1B], Singlepath[1B]), 5V_CAN (in, see Main[5C], AuxSupply_USB[4D]), CAN_GND (see Main[5D], AuxSupply_USB[4D]), CAN_N (bidir, see Main[5C]), CAN_P (bidir, see Main[5C]), ChargeEn (out, see Main[6C]), Currents (in, harness Currents, see Main[6C], PowerPath[3B]), DischgEn (out, see Main[6C]), GND (see Main[5D], AuxSupply_USB[1C], LTC_Hardware[1D], PowerPath[1B], Singlepath[1C]), LTC_H_Config (in, harness LTC_H_Config, see Main[5C]), LTC_Selftest (in, see Main[5C]), LTC_SelftestOK (in, see Main[5C]), OutputEnable (in, see Main[6C], PowerPath[2D], Singlepath[2C]), SPI_LTC (bidir, harness SPI_LTC, see Main[5C], LTC_Soft[3A]), USB_D+ (bidir, see Main[5C], AuxSupply_USB[3A]), USB_D- (bidir, see Main[5C], AuxSupply_USB[3A]), WDT_STM (out, see Main[5C]), ~{ErrorReset} (out, see Main[6C], PowerPath[1D]), ~{HardwareFault} (in, see Main[5C])

### Harnesses
SPI_LTC: MISO, MOSI, SCK, CS
LTC_H_Config: A0_1, A0_2, A0_3, A0_4, A0_5, A0_6, A0_7, A0_8, A1_1, A1_2, A1_3, A1_4, A1_5, A1_6, A1_7, A1_8
Currents: DischgCurrent, DischgRef, ChgRef, ChgCurrent

### Nets
3V3_Stm: C702.2 C703.2 C704.2 C705.2 C706.2 C707.2 C712.2 FB700.2 IC700#1.19(VDD_1) IC700#1.32(VDD_2) IC700#1.48(VDDUSB) IC700#1.64(VDD_3) IC701.1(VIO) J700.1 R711.1 S702.3(NC_1) ; port 3V3  [project net 3.3V]
3V3A_Stm: C700.2 C701.2 FB700.1 IC700#1.13(VDDA/VREF+)
5V_CAN: C709.2 C710.2 IC701.8(VCC) ; port 5V_CAN  [project net 5V]
CAN_GND: C709.1 C710.1 C713.1 D700.3(A) IC701.7(GND) ; port CAN_GND
STM_GND: BT700.3(-) C700.1 C701.1 C702.1 C703.1 C704.1 C705.1 C706.1 C707.1 C708.2 C712.1 C714.2 C715.2 IC700#1.12(VSSA/VREF-) IC700#1.18(VSS_1) IC700#1.31(VSS_2) IC700#1.47(VSS_3) IC700#1.63(VSS_4) IC701.4(VSSIO) IC702.2(K2) J700.3 J700.5 LED700.1(K) LED701.1(K) LED702.1(K) LED703.1(K) LS700.2(-) R704.1 R705.1 R706.1 R707.1 S700.2 S702.1(NO_1) ; port GND  [project net Bat_GND_Fused]
VBat_RTC: BT700.1(+_1) IC700#1.1(VBAT)
A0_1: IC700#2.40(PC9) ; port LTC_H_Config.A0_1
A0_2: IC700#2.52(PC11) ; port LTC_H_Config.A0_2
A0_3: IC700#2.53(PC12) ; port LTC_H_Config.A0_3
A0_4: IC700#2.54(PD2) ; port LTC_H_Config.A0_4
A0_5: IC700#2.56(PB4) ; port LTC_H_Config.A0_5
A0_6: IC700#2.58(PB6) ; port LTC_H_Config.A0_6
A0_7: IC700#2.59(PB7) ; port LTC_H_Config.A0_7
A0_8: IC700#2.6(PH1-OSC_OUT) ; port LTC_H_Config.A0_8
A1_1: IC700#2.39(PC8) ; port LTC_H_Config.A1_1
A1_2: IC700#2.41(PA8) ; port LTC_H_Config.A1_2
A1_3: IC700#2.42(PA9) ; port LTC_H_Config.A1_3
A1_4: IC700#2.43(PA10) ; port LTC_H_Config.A1_4
A1_5: IC700#2.51(PC10) ; port LTC_H_Config.A1_5
A1_6: IC700#2.57(PB5) ; port LTC_H_Config.A1_6
A1_7: IC700#2.2(PC13) ; port LTC_H_Config.A1_7
A1_8: IC700#2.5(PH0-OSC_IN) ; port LTC_H_Config.A1_8
BOOT: IC700#2.60(PH3-BOOT0) S702.2(COM_1)
CAN_N: D700.2(K2) FL700.3 S703.2(COM_1) ; port CAN_N
CAN_P: D700.1(K1) FL700.4 S703.5(COM_2) ; port CAN_P
CAN_Tr_N: FL700.2 IC701.5(CANL)
CAN_Tr_P: FL700.1 IC701.6(CANH)
CANFD_RX: IC700#2.61(PB8) IC701.3(RXD) TP706.1(TP)
CANFD_TX: IC700#2.62(PB9) IC701.2(TXD) TP705.1(TP)
Current1: IC700#2.10(PC2) ; port Currents.ChgCurrent
Current2: IC700#2.16(PA2) ; port Currents.DischgCurrent
CurrRef1: IC700#2.11(PC3) ; port Currents.ChgRef
CurrRef2: IC700#2.17(PA3) ; port Currents.DischgRef
Enable1: IC700#2.24(PC4) ; port ChargeEn
Enable2: IC700#2.26(PB0) ; port DischgEn
~{Fault}: IC700#2.9(PC1) ; port ~{HardwareFault}
JDTO: IC700#2.55(PB3) IC702.5(K3) R714.2
JTCK: IC700#2.49(PA14) IC702.6(K2) R713.2
JTDI: IC700#2.50(PA15) IC702.4(K4) R715.2
JTMS: IC700#2.46(PA13) IC702.1(K1) R712.2
LED_A: IC700#2.29(PB10) R702.2
LED_G: IC700#2.34(PB13) R700.2
LED_R: IC700#2.30(PB11) R703.2
LED_Y: IC700#2.33(PB12) R701.2
NRST: IC700#2.7(NRST) IC702.3(K5) R716.2
OutputEnable: IC700#2.25(PC5) ; port OutputEnable
RST: C708.1 J700.10 R716.1 S700.1
USB_ISO_N: IC700#2.44(PA11) ; port USB_D-
USB_ISO_P: IC700#2.45(PA12) ; port USB_D+
X1: C714.1 IC700#2.3(PC14-OSC32_IN) Y700.1(CRYSTAL_1)
X2: C715.1 IC700#2.4(PC15-OSC32_OUT) Y700.2(CRYSTAL_2)
NetC713_2: C713.2 R708.2 R709.1
NetIC300_20: IC700#2.8(PC0) ; port WDT_STM
NetIC300_28: IC700#2.14(PA0) ; port LTC_SelftestOK
NetIC300_29: IC700#2.15(PA1) ; port LTC_Selftest
NetIC600_41: IC700#2.20(PA4) ; port SPI_LTC.CS
NetIC600_42: IC700#2.21(PA5) ; port SPI_LTC.SCK
NetIC600_43: IC700#2.23(PA7) ; port SPI_LTC.MOSI
NetIC600_44: IC700#2.22(PA6) R711.2 ; port SPI_LTC.MISO
NetIC700#2_27: IC700#2.27(PB1) ; port ~{ErrorReset}
NetIC700#2_28: IC700#2.28(PB2) JS700.1 TP700.1(TP)
NetIC700#2_35: IC700#2.35(PB14) S701.B1
NetIC700#2_36: IC700#2.36(PB15) S701.B2
NetIC700#2_37: IC700#2.37(PC6) S701.B3
NetIC700#2_38: IC700#2.38(PC7) S701.B4
NetJ700_2: J700.2 R712.1
NetJ700_4: J700.4 R713.1
NetJ700_6: J700.6 R714.1
NetJ700_8: J700.8 R715.1
NetJS700_2: JS700.2 LS700.1(+)
NetLED700_2: LED700.2(A) R700.1
NetLED701_2: LED701.2(A) R701.1
NetLED702_2: LED702.2(A) R702.1
NetLED703_2: LED703.2(A) R703.1
NetR704_2: R704.2 S701.A1
NetR705_2: R705.2 S701.A2
NetR706_2: R706.2 S701.A3
NetR707_2: R707.2 S701.A4
NetR708_1: R708.1 S703.6(NC_2)
NetR709_2: R709.2 S703.3(NC_1)

Not connected (* = marked no-connect by the designer): BT700 2(+_2)*; J700 7* 9*; S703 1(NO_1)* 4(NO_2)*

### Layout directives
differential pair: CAN_N, CAN_P, CAN_Tr_N, CAN_Tr_P, USB_ISO_N, USB_ISO_P

### Notes on the sheet
- CAPs
- Decoupling VDDA
- Decoupling VDD 1x100nF/PIN
- (near IC700#1) Supply
- Boot/Reset
- Decoupling VDDUSB
- (near IC700#2) Low Power MCU, with CANFD, USB, RTC and enough IO
- (near S702) Boot = 1 -> Flashmode
  Boot = 0 -> Run from Flash
- (near LED703) ~5mA/LED
- CANFD
- (near S701) Use Internal PullUp
- RTC
- JTAG
- oscillator design Following to AN2867, callibration/capacitor readjustement may be necessary depending on layout
- (near BT700) CR1225(3V)
- (near Y700) Type @ to refer to a designator
- (near LS700) Testpad to measure clock for RTC calibration
- 1
- A3
- Otto Riha

### Library data of the parts
BT700 = 3000TR: Battery; Manufacturer_Name: Keystone Electronics; Datasheet Link: https://www.keyelco.com/produchttps://www.mouser.co.za/datasheet/2/215/3000TR-742873.pdft-pdf.cfm?p=777; Height: 3.43mm; Manufacturer_Part_Number: 3000TR; Mouser Part Number: 534-3000TR; Mouser Price/Stock: https://www.mouser.co.uk/ProductDetail/Keystone-Electronics/3000TR?qs=811De8TLL%252BeRUCmGL5ZsKg%3D%3D; Arrow Part Number: 3000TR; Arrow Price/Stock: https://www.arrow.com/en/products/3000tr/keystone-electronics?utm_currency=USD&region=europe
C700 = 06035C105MAT2A: as C411 on sheet AuxSupply_USB; Datasheet Link: https://componentsearchengine.com/Datasheets/1/06031A100FAT2A.pdf; Height: 0.9mm; Manufacturer_Part_Number: 06035C105MAT2A; Mouser Part Number: 581-06035C105MAT2A; Mouser Price/Stock: https://www.mouser.co.uk/ProductDetail/KYOCERA-AVX/06035C105MAT2A?qs=%252BdQmOuGyFcHMsevPtc6OZQ%3D%3D; Value: 1uF
C701 C703-C705 C707 C708 C710 C712 = MAJCH168BB7104KTEA01: as C303 on sheet LTC_Hardware; Datasheet Link: https://ds.yuden.co.jp/TYCOMPAS/or/detail?pn=MAJCH168BB7104KTEA01; Height: 0.8mm; Manufacturer_Part_Number: MAJCH168BB7104KTEA01; Mouser Part Number: 963-MAJCH168BB7104KT; Mouser Price/Stock: https://www.mouser.co.uk/ProductDetail/TAIYO-YUDEN/MAJCH168BB7104KTEA01?qs=ZcfC38r4PovaTBrG0IdezQ%3D%3D; Arrow Part Number: MAJCH168BB7104KTEA01; Arrow Price/Stock: https://www.arrow.com/en/products/majch168bb7104ktea01/taiyo-yuden?utm_currency=USD&region=nac; Supplier 1: Mouser; Supplier Part Number 1: 963-MAJCH168BB7104KT
C702 C706 C709 = GRM188Z71A475KE15J: Capacitor  4.7uF, 10V, X7R; Manufacturer_Name: Murata Electronics; Datasheet Link: https://search.murata.co.jp/Ceramy/image/img/A01X/G101/ENG/GRM188Z71A475KE15-01A.pdf; Height: 0.9mm; Manufacturer_Part_Number: GRM188Z71A475KE15J; Mouser Part Number: 81-GRM188Z71A475KE5J; Mouser Price/Stock: https://www.mouser.co.uk/ProductDetail/Murata-Electronics/GRM188Z71A475KE15J?qs=Ey7%2FXF42M3fe52ZB0l7gLw%3D%3D; Supplier 1: Mouser; Supplier Part Number 1: 81-GRM188Z71A475KE5J
C713 = C1608X7R2A472K080AA: Capacitor 4.7nF 100V X7R; Manufacturer_Name: TDK; Datasheet Link: https://product.tdk.com/info/en/catalog/datasheets/mlcc_commercial_midvoltage_en.pdf; Height: 0.8mm; Manufacturer_Part_Number: C1608X7R2A472K080AA; Mouser Part Number: 810-C1608X7R2A472K; Mouser Price/Stock: https://www.mouser.co.uk/ProductDetail/TDK/C1608X7R2A472K080AA/?qs=NRhsANhppD8eiVaujK4TFA%3D%3D; Arrow Part Number: C1608X7R2A472K080AA; Arrow Price/Stock: https://www.arrow.com/en/products/c1608x7r2a472k080aa/tdk?utm_currency=USD&region=nac; Value: 4.7nF 100V
C714 C715 = 06035A100BAT2A: Capacitor 10pF 50V C0G; Manufacturer_Name: Kyocera AVX; Datasheet Link: https://componentsearchengine.com/Datasheets/1/06031A100FAT2A.pdf; Height: 0.9mm; Manufacturer_Part_Number: 06035A100BAT2A; Mouser Part Number: 581-06035A100BAT2A; Mouser Price/Stock: https://www.mouser.com/Search/Refine.aspx?Keyword=581-06035A100BAT2A
D700 = PESD2CANFD27V-TR: Diode; Manufacturer_Name: Nexperia; Datasheet Link: https://assets.nexperia.com/documents/data-sheet/PESD2CANFD27V-T.pdf; Height: 1.1mm; Manufacturer_Part_Number: PESD2CANFD27V-TR; Mouser Part Number: 771-PESD2CANFD27V-TR; Mouser Price/Stock: https://www.mouser.co.uk/ProductDetail/Nexperia/PESD2CANFD27V-TR?qs=OlC7AqGiEDlVVUGGaoaotA%3D%3D; Arrow Part Number: PESD2CANFD27V-TR; Arrow Price/Stock: null?utm_currency=USD&region=nac
FB700 = CMP-0220-00149-2: FERRITE BEAD 1.5 KOHM 0805 1LN; Max DC Current: 1A; Test Frequency: 100MHz; Impedance: 1.5kR; Inductance: 1.8nH; Tolerance: 25%; Number of Lines: 1; Weight: 0.000388oz; Case Code (Metric): 2012; Material: Ferrite; Width: 1.2mm; Mount: Surface Mount; Packaging: Tape and Reel; Case/Package: SMD/SMT; Case Code (Imperial): 0805; RoHS Compliant: Yes; Series: WE-CBF; Lead Free: Lead Free; Termination: SMD/SMT; Core Material: Ferrite; Depth: 1.2mm; Min Operating Temperature: -55°C; Height: 0.9mm; Current Rating: 1A; Length: 2mm; Max Operating Temperature: 125°C; Max Current Rating: 1A; Package Quantity: 4000
FL700 = ACE1V2012-121-R: Filter; Manufacturer_Name: Eaton; Datasheet Link: https://www.eaton.com/content/dam/eaton/products/electronic-components/resources/data-sheet/eaton-ace1v2012-automotive-common-mode-chip-inductor-data-sheet.pdf; Height: 1.4mm; Manufacturer_Part_Number: ACE1V2012-121-R; Mouser Part Number: 504-ACE1V2012-121-R; Mouser Price/Stock: https://www.mouser.co.uk/ProductDetail/Coiltronics-Eaton/ACE1V2012-121-R?qs=YwPsRIUVAOfYW6FI0EMgkw%3D%3D
IC700#1 IC700#2 = STM32L552RET6: Integrated Circuit; Manufacturer_Name: STMicroelectronics; Datasheet Link: https://www.mouser.in/datasheet/2/389/dm00532748-1799512.pdf; Height: 1.6mm; Manufacturer_Part_Number: STM32L552RET6; Mouser Part Number: 511-STM32L552RET6; Mouser Price/Stock: https://www.mouser.co.uk/ProductDetail/STMicroelectronics/STM32L552RET6?qs=%252B6g0mu59x7I6Ku2G1CuBXA%3D%3D; Arrow Part Number: STM32L552RET6; Arrow Price/Stock: https://www.arrow.com/en/products/stm32l552ret6/stmicroelectronics?region=nac
IC701 = ISO1044BDR: Integrated Circuit; Manufacturer_Name: Texas Instruments; Datasheet Link: http://www.ti.com/lit/gpn/iso1044?HQS=ti-null-null-sf-df-pf-sep-wwe&DCM=yes; Height: 1.75mm; Manufacturer_Part_Number: ISO1044BDR; Mouser Part Number: 595-ISO1044BDR; Mouser Price/Stock: https://www.mouser.co.uk/ProductDetail/Texas-Instruments/ISO1044BDR?qs=DuoOggApuK9UGD9QQWYeTA%3D%3D; Arrow Part Number: ISO1044BDR; Arrow Price/Stock: https://www.arrow.com/en/products/iso1044bdr/texas-instruments?utm_currency=USD&region=nac
IC702 = ESDA6V1-5SC6: Integrated Circuit; Manufacturer_Name: STMicroelectronics; Datasheet Link: http://www.st.com/st-web-ui/static/active/en/resource/technical/document/datasheet/CD00005102.pdf; Height: 1.45mm; Manufacturer_Part_Number: ESDA6V1-5SC6; Mouser Part Number: 511-ESDA6V1-5SC6; Mouser Price/Stock: https://www.mouser.co.uk/ProductDetail/STMicroelectronics/ESDA6V1-5SC6?qs=ZN9SVtODT3yxqNpCUKP6Bg%3D%3D; Arrow Part Number: ESDA6V1-5SC6; Arrow Price/Stock: https://www.arrow.com/en/products/esda6v1-5sc6/stmicroelectronics?region=nac
J700 = FTSH-105-01-L-DV-K: Connector; Manufacturer_Name: SAMTEC; Datasheet Link: https://www.arrow.com/en/products/ftsh-105-01-l-dv-k/samtec; Height: 6.1mm; Manufacturer_Part_Number: FTSH-105-01-L-DV-K; Mouser Part Number: 200-FTSH10501LDVK; Mouser Price/Stock: https://www.mouser.co.uk/ProductDetail/Samtec/FTSH-105-01-L-DV-K?qs=%252B5JSS813miOqo3Vy%252BvhCFg%3D%3D; Arrow Part Number: FTSH-105-01-L-DV-K; Arrow Price/Stock: https://www.arrow.com/en/products/ftsh-105-01-l-dv-k/samtec?utm_currency=USD&region=europe
LED700 = 150060VS75000: LED; Manufacturer_Name: Wurth Elektronik; Datasheet Link: https://componentsearchengine.com/Datasheets/2/150060VS75000.pdf; Height: 0.8mm; Manufacturer_Part_Number: 150060VS75000; Mouser Part Number: 710-150060VS75000; Mouser Price/Stock: https://www.mouser.co.uk/ProductDetail/Wurth-Elektronik/150060VS75000?qs=LlUlMxKIyB1Q1Bi5mQ%2FKLw%3D%3D
LED701 = 150060YS75000: LED; Manufacturer_Name: Wurth Elektronik; Datasheet Link: http://uk.rs-online.com/web/p/products/8154219; Height: 0.8mm; Manufacturer_Part_Number: 150060YS75000; Mouser Part Number: 710-150060YS75000; Mouser Price/Stock: https://www.mouser.co.uk/ProductDetail/Wurth-Elektronik/150060YS75000?qs=LlUlMxKIyB0nKmwefHgtZw%3D%3D
LED702 = 150060AS75000: LED; Manufacturer_Name: Wurth Elektronik; Datasheet Link: https://componentsearchengine.com/Datasheets/2/150060AS75000.pdf; Height: 0.8mm; Manufacturer_Part_Number: 150060AS75000; Mouser Part Number: 710-150060AS75000; Mouser Price/Stock: https://www.mouser.co.uk/ProductDetail/Wurth-Elektronik/150060AS75000?qs=d0WKAl%252BL4KbvMBYryeof0Q%3D%3D
LED703 = 150060RS75000: LED; Manufacturer_Name: Wurth Elektronik; Datasheet Link: http://katalog.we-online.de/led/datasheet/150060RS75000.pdf; Height: 0.8mm; Manufacturer_Part_Number: 150060RS75000; Mouser Part Number: 710-150060RS75000; Mouser Price/Stock: https://www.mouser.co.uk/ProductDetail/Wurth-Elektronik/150060RS75000?qs=LlUlMxKIyB3QnmZ3fw%2FVCA%3D%3D
LS700 = CPT-1625-80-SMT-TR: Loudspeaker or Buzzer; Manufacturer_Name: Same Sky; Datasheet Link: https://www.sameskydevices.com/product/resource/supplyframepdf/cpt-1625-80-smt-tr.pdf; Height: 3mm; Manufacturer_Part_Number: CPT-1625-80-SMT-TR; Mouser Part Number: 490-CPT-1625-80SMTTR; Mouser Price/Stock: https://www.mouser.co.uk/ProductDetail/CUI-Devices/CPT-1625-80-SMT-TR?qs=P1JMDcb91o43eCFIymFs3Q%3D%3D
R700-R703 = ERJ-3EKF2700V: Resistor 270R 1%; Manufacturer_Name: Panasonic; Datasheet Link: http://industrial.panasonic.com/cdbs/www-data/pdf/RDA0000/AOA0000C86.pdf; Height: 0.55mm; Manufacturer_Part_Number: ERJ-3EKF2700V; Mouser Part Number: 667-ERJ-3EKF2700V; Mouser Price/Stock: https://www.mouser.co.uk/ProductDetail/Panasonic/ERJ-3EKF2700V?qs=iBwFsHVUAOdaUVxng5ojCw%3D%3D; Arrow Part Number: ERJ-3EKF2700V; Arrow Price/Stock: https://www.arrow.com/en/products/erj-3ekf2700v/panasonic?region=nac; Value: 270R
R704-R707 R712-R716 = RC0603FR-0722RL: Resistor 22Ohm 1%; Manufacturer_Name: YAGEO; Datasheet Link: http://www.farnell.com/datasheets/1868787.pdf; Height: 0.55mm; Manufacturer_Part_Number: RC0603FR-0722RL; Mouser Part Number: 603-RC0603FR-0722RL; Mouser Price/Stock: https://www.mouser.co.uk/ProductDetail/YAGEO/RC0603FR-0722RL?qs=diQw95jMAeMOsxb8bne7fg%3D%3D; Arrow Part Number: RC0603FR-0722RL; Arrow Price/Stock: https://www.arrow.com/en/products/rc0603fr-0722rl/yageo?region=nac; Supplier 1: Future Electronics; Supplier Part Number 1: 8636706
  R704-R707 R716: Value: 22Ohm
R708 R709 = CPF0603F60R4C1: Resistor 60.4R, 1%; Manufacturer_Name: TE Connectivity; Datasheet Link: https://www.te.com/commerce/DocumentDelivery/DDEController?Action=srchrtrv&DocNm=8-1773459-4_ELEVATOR_ESCALATOR_SOLUTIONS&DocType=Data%20Sheet&DocLang=English&PartCntxt=4-1879335-4&DocFormat=pdf; Height: 0.55mm; Manufacturer_Part_Number: CPF0603F60R4C1; Mouser Part Number: 279-CPF0603F60R4C1; Value: 60.4R; Supplier 1: Mouser; Supplier Part Number 1: 279-CPF0603F60R4C1
R711 = CRCW06035K10FKEBC: Resistor 5.1k, 1%; Manufacturer_Name: Vishay; Datasheet Link: https://www.vishay.com/docs/28773/crcwce3.pdf; Height: 0.55mm; Manufacturer_Part_Number: CRCW06035K10FKEBC; Mouser Part Number: 71-CRCW06035K10FKEBC; Mouser Price/Stock: https://www.mouser.co.uk/ProductDetail/Vishay-Dale/CRCW06035K10FKEBC?qs=wd5RIQLrsJiajonkePuzqw%3D%3D; Arrow Part Number: CRCW06035K10FKEBC; Arrow Price/Stock: https://www.arrow.com/en/products/crcw06035k10fkebc/vishay?region=nac; Value: 5.1k; Supplier 1: Mouser; Supplier Part Number 1: 71-CRCW06035K10FKEBC
S700 = MJTP1140A: Switch; Manufacturer_Name: Apem; Datasheet Link: https://componentsearchengine.com/Datasheets/1/MJTP1140A.pdf; Height: 1.5mm; Manufacturer_Part_Number: MJTP1140A; Mouser Part Number: 642-MJTP1140A; Mouser Price/Stock: https://www.mouser.com/Search/Refine.aspx?Keyword=642-MJTP1140A
S701 = 218-4LPSTJ: Switch; Manufacturer_Name: CTS; Datasheet Link: https://www.ctscorp.com/wp-content/uploads/218.pdf; Height: 2.7mm; Manufacturer_Part_Number: 218-4LPSTJ; Mouser Part Number: 774-218-4LPSTJ; Mouser Price/Stock: https://www.mouser.co.uk/ProductDetail/CTS-Electronic-Components/218-4LPSTJ?qs=qNzHFtQhdJ%2Frpuf7cnHHWA%3D%3D; Arrow Part Number: 218-4LPSTJ; Arrow Price/Stock: https://www.arrow.com/en/products/218-4lpstj/cts
S702 = CAS-120TA: Switch; Manufacturer_Name: Nidec Copal; Datasheet Link: https://www.mouser.com/datasheet/2/972/cas-1628136.pdf; Height: 2.5mm; Manufacturer_Part_Number: CAS-120TA; Mouser Part Number: 229-CAS-120TA; Mouser Price/Stock: https://www.mouser.co.uk/ProductDetail/Nidec-Components/CAS-120TA?qs=XeJtXLiO41SaUq1d6RzxrQ%3D%3D; Arrow Part Number: CAS-120TA; Arrow Price/Stock: https://www.arrow.com/en/products/cas-120ta/nidec-copal-electronics
S703 = CAS-220TA: Switch; Manufacturer_Name: Nidec Copal; Datasheet Link: https://www.digikey.ph/en/products/detail/nidec-components-corporation/CAS-220TA/341663?msockid=39f1ec84d77b6f4428b7f904d6676eed; Height: 2.5mm; Manufacturer_Part_Number: CAS-220TA; Mouser Part Number: 229-CAS-220TA; Mouser Price/Stock: https://www.mouser.co.uk/ProductDetail/Nidec-Components/CAS-220TA?qs=XeJtXLiO41Tq8gHkPWHRfA%3D%3D
Y700 = FC-135_32.7680KA-AG0: Crystal or Oscillator; Manufacturer_Name: Epson Timing; Manufacturer_Part_Number: FC-135 32.7680KA-AG0; Datasheet Link: https://support.epson.biz/td/api/doc_check.php?dl=brief_FC-135&lang=en/.pdf; Height: 0.9mm; Mouser Part Number: 732-FC135-32.76KAAG0; Mouser Price/Stock: https://www.mouser.co.uk/ProductDetail/Epson-Timing/FC-135-32.7680KA-AG0?qs=l3LL3yk8ONZCQSM4diwOUg%3D%3D; Arrow Part Number: FC-135 32.7680KA-AG0; Arrow Price/Stock: https://www.arrow.com/en/products/fc-13532.7680ka-ag0/epson-electronics-america?utm_currency=USD&region=nac

## Sheet PowerPath.SchDoc
size A4; SheetNumber: 9; SheetTotal: 10
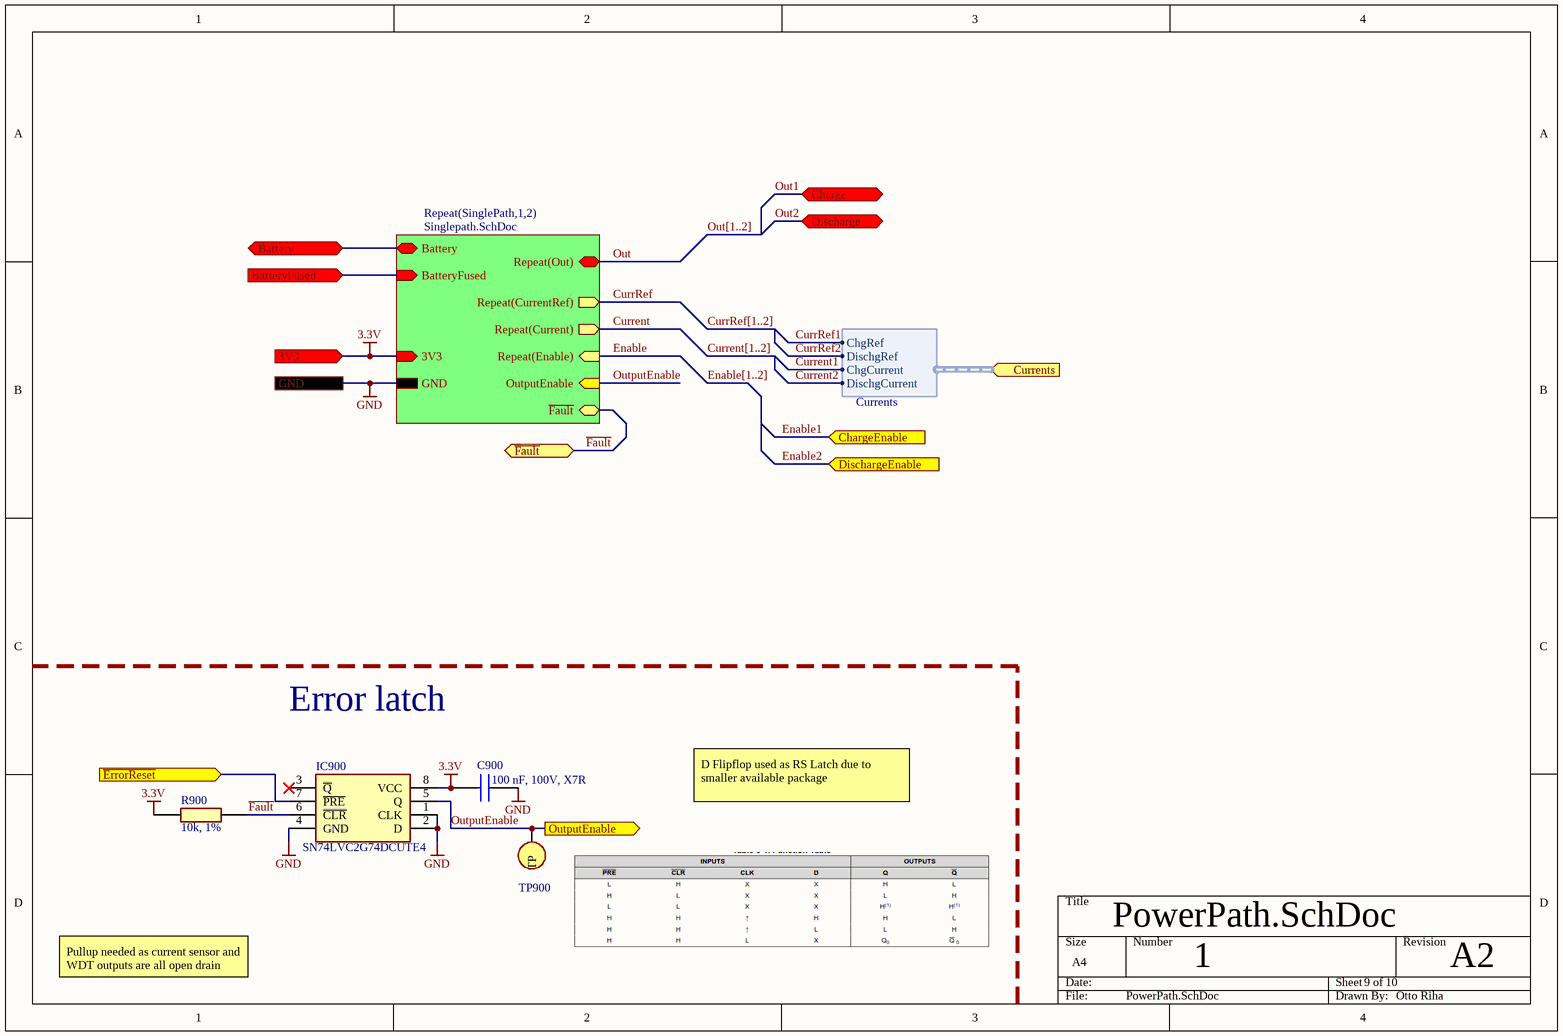
[diagram p8: PowerPath.SchDoc]

### Parts
C900  100 nF, 100V, X7R  [MAJx16]
IC900  SN74LVC2G74DCUTE4  [SOP50P310X90-8N]
R900  value 10k, 1%  [RESC1608X50N]  (hidden comment: CRCW060310K0FKEI)
TP900  Testpoint  [Testpoint]  (value not drawn)

### Sub-sheets
Repeat(SinglePath,1,2) = Singlepath.SchDoc: GND, Battery (bidir), Repeat(Out) (bidir), Repeat(CurrentRef) (out), Repeat(Current) (out), Repeat(Enable) (in), ~{Fault} (bidir), 3V3 (in), BatteryFused (in), OutputEnable (in)

### Ports
3V3 (in, see Main[4B], AuxSupply_USB[2D], MCU[1A], Singlepath[1B]), Battery (bidir, see Main[4A], Singlepath[2B]), BatteryFused (in, see Main[4B], Singlepath[2C]), Charge (bidir, see Main[5A]), ChargeEnable (in, see Main[5B]), Currents (in, harness Currents, see Main[5B], MCU[3B]), Discharge (bidir, see Main[5B]), DischargeEnable (in, see Main[5B]), GND (see Main[4B], AuxSupply_USB[1C], LTC_Hardware[1D], MCU[1A], Singlepath[1C]), OutputEnable (out, see Main[5B], MCU[3C], Singlepath[2C]), ~{ErrorReset} (in, see Main[5B], MCU[3C]), ~{Fault} (bidir, see Main[5B], Singlepath[1B])

### Harnesses
Currents: DischgCurrent, DischgRef, ChgRef, ChgCurrent

### Nets
3.3V: C900.1 IC900.8(VCC) R900.1 ; port 3V3, sheet Repeat(SinglePath,1,2)/3V3
GND: C900.2 IC900.1(CLK) IC900.2(D) IC900.4(GND) ; port GND, sheet Repeat(SinglePath,1,2)/GND  [project net Bat_GND_Fused]
V_Bat: port Battery, sheet Repeat(SinglePath,1,2)/Battery
V_Bat_Fused: port BatteryFused, sheet Repeat(SinglePath,1,2)/BatteryFused
Current: sheet Repeat(SinglePath,1,2)/Repeat(Current)
CurrRef: sheet Repeat(SinglePath,1,2)/Repeat(CurrentRef)
Enable: sheet Repeat(SinglePath,1,2)/Repeat(Enable)
~{Fault}: IC900.6(~{CLR}) R900.2 ; port ~{Fault}, sheet Repeat(SinglePath,1,2)/~{Fault}
Out: sheet Repeat(SinglePath,1,2)/Repeat(Out)
OutputEnable: IC900.5(Q) TP900.1(TP) ; port OutputEnable, sheet Repeat(SinglePath,1,2)/OutputEnable
NetIC700#2_27: IC900.7(~{PRE}) ; port ~{ErrorReset}

Not connected (* = marked no-connect by the designer): IC900 3(~{Q})*

### Buses and harness runs
bus Current[1..2]
bus CurrRef[1..2]
bus Enable[1..2]
bus Out[1..2]

### Notes on the sheet
- Error latch
- D Flipflop used as RS Latch due to smaller available package
- Pullup needed as current sensor and WDT outputs are all open drain
- 1
- A2
- Otto Riha

### Library data of the parts
C900 = MAJCH168BB7104KTEA01: Capacitor 100nF, 100V, X7R; Manufacturer_Name: TAIYO YUDEN; Datasheet Link: https://ds.yuden.co.jp/TYCOMPAS/or/detail?pn=MAJCH168BB7104KTEA01; Height: 0.8mm; Manufacturer_Part_Number: MAJCH168BB7104KTEA01; Mouser Part Number: 963-MAJCH168BB7104KT; Mouser Price/Stock: https://www.mouser.co.uk/ProductDetail/TAIYO-YUDEN/MAJCH168BB7104KTEA01?qs=ZcfC38r4PovaTBrG0IdezQ%3D%3D; Arrow Part Number: MAJCH168BB7104KTEA01; Arrow Price/Stock: https://www.arrow.com/en/products/majch168bb7104ktea01/taiyo-yuden?utm_currency=USD&region=nac; Supplier 1: Mouser; Supplier Part Number 1: 963-MAJCH168BB7104KT
IC900 = SN74LVC2G74DCUTE4: Integrated Circuit; Manufacturer_Name: Texas Instruments; Datasheet Link: https://www.ti.com/lit/ds/symlink/sn74lvc2g74.pdf?ts=1620105032147&ref_url=https%253A%252F%252Fwww.ti.com%252Fsitesearch%252Fdocs%252Funiversalsearch.tsp%253FsearchTerm%253DSN74LVC2G74DCURE4; Height: 0.9mm; Manufacturer_Part_Number: SN74LVC2G74DCUTE4; Mouser Part Number: 595-74LVC2G74DCUTE4; Mouser Price/Stock: https://www.mouser.co.uk/ProductDetail/Texas-Instruments/SN74LVC2G74DCUTE4?qs=0smPjiIwnfLoccl5Dt0mHg%3D%3D; Arrow Part Number: SN74LVC2G74DCUTE4; Arrow Price/Stock: https://www.arrow.com/en/products/sn74lvc2g74dcute4/texas-instruments
R900 = CRCW060310K0FKEI: Resistor 10k, 1%; Manufacturer_Name: Vishay; Datasheet Link: http://www.vishay.com/docs/20035/dcrcwe3.pdf; Height: 0.5mm; Manufacturer_Part_Number: CRCW060310K0FKEI; Mouser Part Number: 71-CRCW060310K0FKEI; Mouser Price/Stock: https://www.mouser.co.uk/ProductDetail/Vishay-Dale/CRCW060310K0FKEI?qs=3qWEzBg5KnKofE%252B8acPBRA%3D%3D; Arrow Part Number: CRCW060310K0FKEI; Arrow Price/Stock: https://www.arrow.com/en/products/crcw060310k0fkei/vishay?utm_currency=USD&region=nac; Supplier 1: Mouser; Supplier Part Number 1: 71-CRCW060310K0FKEI